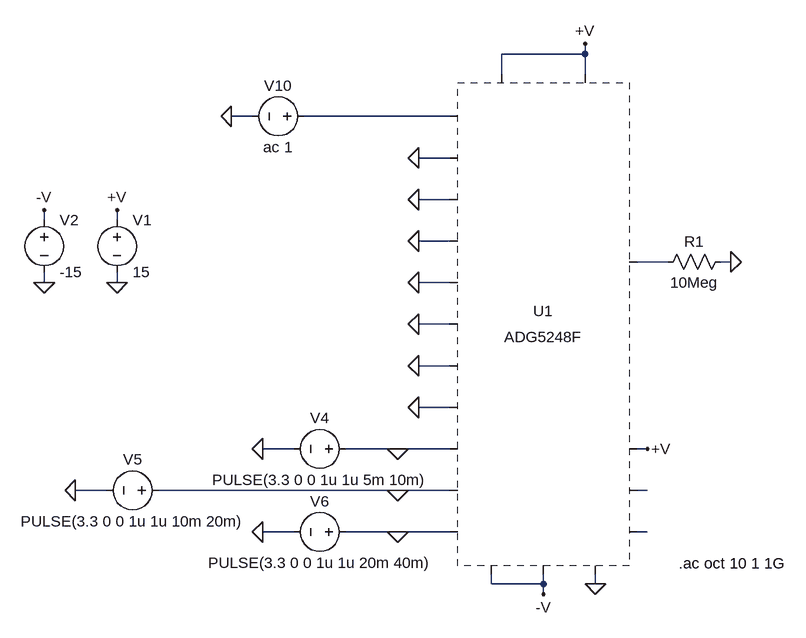
[diagram p0: schematic ac.asc]
ac.asc, the LTspice schematic file:
Version 4
SHEET 1 2844 1336
WIRE 864 -432 864 -448
WIRE 864 -432 736 -432
WIRE 736 -400 736 -432
WIRE 864 -400 864 -432
WIRE 352 -336 320 -336
WIRE 656 -336 432 -336
WIRE 656 -272 608 -272
WIRE 656 -208 608 -208
WIRE 32 -176 32 -192
WIRE 144 -176 144 -192
WIRE 656 -144 608 -144
WIRE 992 -112 944 -112
WIRE 1088 -112 1072 -112
WIRE 32 -80 32 -96
WIRE 144 -80 144 -96
WIRE 656 -80 608 -80
WIRE 656 -16 608 -16
WIRE 656 48 608 48
WIRE 656 112 608 112
WIRE 416 176 368 176
WIRE 576 176 496 176
WIRE 656 176 576 176
WIRE 960 176 944 176
WIRE 128 240 80 240
WIRE 576 240 208 240
WIRE 656 240 576 240
WIRE 960 240 944 240
WIRE 416 304 368 304
WIRE 576 304 496 304
WIRE 656 304 576 304
WIRE 960 304 944 304
WIRE 720 384 720 368
WIRE 800 384 800 368
WIRE 800 384 720 384
WIRE 880 384 880 368
WIRE 800 400 800 384
FLAG 32 -80 0
FLAG 144 -80 0
FLAG 144 -192 +V
FLAG 32 -192 -V
FLAG 800 400 -V
FLAG 864 -448 +V
FLAG 880 384 0
FLAG 368 176 0
FLAG 1088 -112 0
FLAG 80 240 0
FLAG 368 304 0
FLAG 320 -336 0
FLAG 960 176 +V
FLAG 608 -272 0
FLAG 608 -144 0
FLAG 608 -16 0
FLAG 608 112 0
FLAG 608 -208 0
FLAG 608 -80 0
FLAG 608 48 0
FLAG 576 176 0
FLAG 576 240 0
FLAG 576 304 0
SYMBOL voltage 144 -192 R0
WINDOW 123 0 0 Left 0
WINDOW 39 0 0 Left 0
SYMATTR InstName V1
SYMATTR Value 15
SYMBOL voltage 32 -192 R0
WINDOW 123 0 0 Left 0
WINDOW 39 0 0 Left 0
SYMATTR InstName V2
SYMATTR Value -15
SYMBOL voltage 512 176 R90
WINDOW 0 -32 56 VBottom 2
WINDOW 3 32 56 VTop 2
WINDOW 123 0 0 Left 0
WINDOW 39 0 0 Left 0
SYMATTR InstName V4
SYMATTR Value PULSE(3.3 0 0 1u 1u 5m 10m)
SYMBOL voltage 224 240 R90
WINDOW 0 -32 56 VBottom 2
WINDOW 3 32 56 VTop 2
WINDOW 123 0 0 Left 0
WINDOW 39 0 0 Left 0
SYMATTR InstName V5
SYMATTR Value PULSE(3.3 0 0 1u 1u 10m 20m)
SYMBOL voltage 512 304 R90
WINDOW 0 -32 56 VBottom 2
WINDOW 3 32 56 VTop 2
WINDOW 123 0 0 Left 0
WINDOW 39 0 0 Left 0
SYMATTR InstName V6
SYMATTR Value PULSE(3.3 0 0 1u 1u 20m 40m)
SYMBOL voltage 448 -336 R90
WINDOW 0 -32 56 VBottom 2
WINDOW 3 32 56 VTop 2
WINDOW 123 0 0 Left 0
WINDOW 39 0 0 Left 0
SYMATTR InstName V10
SYMATTR Value ac 1
SYMBOL Switches\\ADG5248F 800 -80 R0
SYMATTR InstName U1
SYMBOL res 1088 -128 R90
WINDOW 0 0 56 VBottom 2
WINDOW 3 32 56 VTop 2
SYMATTR InstName R1
SYMATTR Value 10Meg
TEXT 1008 352 Left 2 !.ac oct 10 1 1G

The netlist it stands for:
* ac.asc
V1 +V 0 15
V2 -V 0 -15
V4 0 0 PULSE(3.3 0 0 1u 1u 5m 10m)
V5 0 0 PULSE(3.3 0 0 1u 1u 10m 20m)
V6 0 0 PULSE(3.3 0 0 1u 1u 20m 40m)
V10 N001 0 ac 1
* U1: ADG5248F (symbol Switches\ADG5248F not available, pin order unknown); nets seen at it: +V, -V, 0, N001, N002, N003, N004
R1 0 N002 10Meg
.ac oct 10 1 1G
.backanno
.end